# EAGLE design 3DS Cartridge (EAGLE 9.1.3)
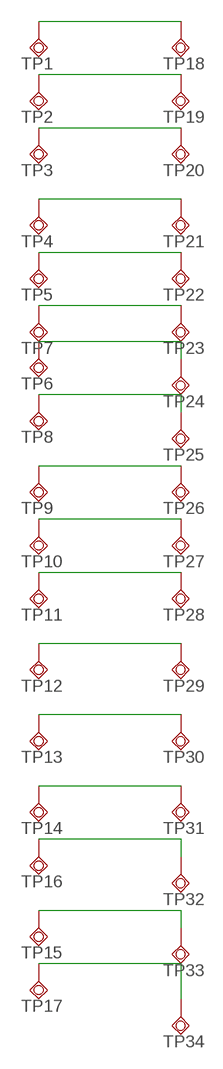
[diagram p0: schematic, sheet 1]

## Parts
TP1  TPSQTP12SQ  [TP12SQ]
TP2  TPSQTP12SQ  [TP12SQ]
TP3  TPSQTP12SQ  [TP12SQ]
TP4  TPSQTP12SQ  [TP12SQ]
TP5  TPSQTP12SQ  [TP12SQ]
TP6  TPSQTP12SQ  [TP12SQ]
TP7  TPSQTP12SQ  [TP12SQ]
TP8  TPSQTP12SQ  [TP12SQ]
TP9  TPSQTP12SQ  [TP12SQ]
TP10  TPSQTP12SQ  [TP12SQ]
TP11  TPSQTP12SQ  [TP12SQ]
TP12  TPSQTP12SQ  [TP12SQ]
TP13  TPSQTP12SQ  [TP12SQ]
TP14  TPSQTP12SQ  [TP12SQ]
TP15  TPSQTP12SQ  [TP12SQ]
TP16  TPSQTP12SQ  [TP12SQ]
TP17  TPSQTP12SQ  [TP12SQ]
TP18  TPSQTP12SQ  [TP12SQ]
TP19  TPSQTP12SQ  [TP12SQ]
TP20  TPSQTP12SQ  [TP12SQ]
TP21  TPSQTP12SQ  [TP12SQ]
TP22  TPSQTP12SQ  [TP12SQ]
TP23  TPSQTP12SQ  [TP12SQ]
TP24  TPSQTP12SQ  [TP12SQ]
TP25  TPSQTP12SQ  [TP12SQ]
TP26  TPSQTP12SQ  [TP12SQ]
TP27  TPSQTP12SQ  [TP12SQ]
TP28  TPSQTP12SQ  [TP12SQ]
TP29  TPSQTP12SQ  [TP12SQ]
TP30  TPSQTP12SQ  [TP12SQ]
TP31  TPSQTP12SQ  [TP12SQ]
TP32  TPSQTP12SQ  [TP12SQ]
TP33  TPSQTP12SQ  [TP12SQ]
TP34  TPSQTP12SQ  [TP12SQ]

## Nets
N$1: TP1.TP TP18.TP
N$2: TP2.TP TP19.TP
N$3: TP3.TP TP20.TP
N$4: TP4.TP TP21.TP
N$5: TP5.TP TP22.TP
N$6: TP7.TP TP23.TP
N$7: TP6.TP TP24.TP
N$8: TP8.TP TP25.TP
N$9: TP9.TP TP26.TP
N$10: TP10.TP TP27.TP
N$11: TP11.TP TP28.TP
N$12: TP12.TP TP29.TP
N$13: TP13.TP TP30.TP
N$14: TP14.TP TP31.TP
N$15: TP16.TP TP32.TP
N$16: TP15.TP TP33.TP
N$17: TP17.TP TP34.TP

## Library data of the parts
TP1-TP34 = testpad:TPSQ: Test pad

## Board
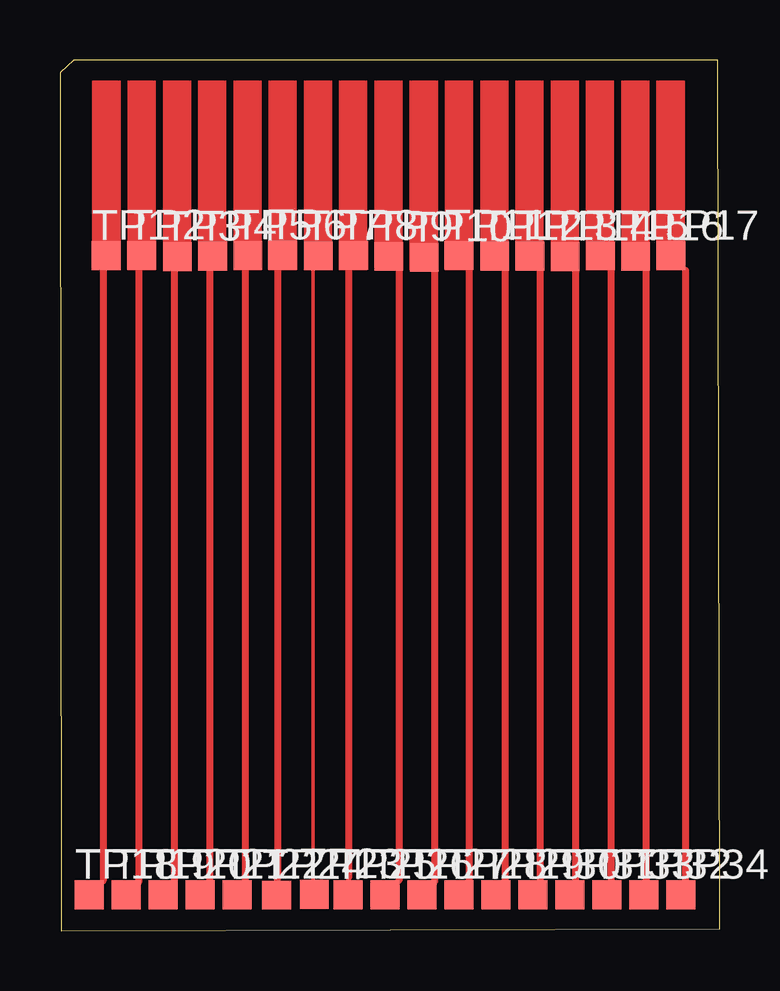
[diagram p1: board, top side]

Size 27.52 x 36.3 mm. Coordinates in mm from the lower left corner, seen from the top.
Outline: 0.05,0 27.52,0.08 27.42,36.3 0.57,36.3 0,35.76 0.05,0
Copper layers (1*16): Top 0.035mm / dielectric 1.5mm / Bottom 0.035mm
Design rules "default": minimum track width 6mil, minimum drill 0.35mm, track to track 6mil, track to pad 6mil, pad to pad 6mil, via to via 6mil, smd to smd 6mil, copper to edge 40mil, drill to drill 6mil, minimum pad ring 10mil, minimum via ring 8mil, stop-mask expansion 4mil, vias tented up to drill 0mil, thermal gap 10mil

### Footprints (pad centres in the part's own frame; a part is rotated, then mirrored left to right if it is on the bottom)
TP12SQ = smd 1.2 x 1.2: TP 0,0

### Placement (x,y rotation side)
TP1  1.92,28.14 0 top
TP2  3.4,28.15 0 top
TP3  4.89,28.1 0 top
TP4  6.37,28.11 0 top
TP5  7.84,28.15 0 top
TP6  9.28,28.16 0 top
TP7  10.77,28.13 0 top
TP8  12.24,28.15 0 top
TP9  13.71,28.11 0 top
TP10  15.19,28.07 0 top
TP11  16.64,28.15 0 top
TP12  18.13,28.12 0 top
TP13  19.59,28.12 0 top
TP14  21.06,28.1 0 top
TP15  22.54,28.13 0 top
TP16  24,28.11 0 top
TP17  25.48,28.13 0 top
TP18  1.22,1.5 0 top
TP19  2.76,1.5 0 top
TP20  4.3,1.5 0 top
TP21  5.84,1.5 0 top
TP22  7.39,1.5 0 top
TP23  10.6,1.52 0 top
TP24  9.03,1.49 0 top
TP25  12.01,1.5 0 top
TP26  13.55,1.5 0 top
TP27  15.09,1.5 0 top
TP28  16.63,1.5 0 top
TP29  18.18,1.5 0 top
TP30  19.72,1.5 0 top
TP31  21.26,1.5 0 top
TP32  24.34,1.5 0 top
TP33  22.8,1.5 0 top
TP34  25.88,1.5 0 top

### Tracks (layer width: path | path; a pad name or v marks a point on that pad's centre or on a via)
N$1
  Top 0.152: 1.8,2.08 TP18.TP | TP1.TP 1.8,28.01
  Top 0.3: 1.8,28.01 1.8,2.08
N$2
  Top 0.152: 3.28,2.01 TP19.TP | TP2.TP 3.28,28.02
  Top 0.3: 3.28,28.02 3.28,2.01
N$3
  Top 0.152: 4.77,1.96 TP20.TP | TP3.TP 4.77,27.98
  Top 0.3: 4.77,27.98 4.77,1.96
N$4
  Top 0.152: 6.24,1.9 TP21.TP | TP4.TP 6.24,27.99
  Top 0.3: 6.24,27.99 6.24,1.9
N$5
  Top 0.152: 7.71,1.82 TP22.TP | TP5.TP 7.71,28.02
  Top 0.3: 7.71,28.02 7.71,1.82
N$6
  Top 0.152: 10.55,27.91 10.55,1.57 TP23.TP
  Top 0.3: TP7.TP 10.55,27.91
N$7
  Top 0.152: 9.07,2.16 9.03,2.12 TP24.TP
  Top 0.3: 9.07,2.16 9.07,27.95 TP6.TP
N$8
  Top 0.152: 12.03,2.24 12.01,2.22 TP25.TP
  Top 0.3: 12.03,2.24 12.03,27.94 TP8.TP
N$9
  Top 0.152: 14.13,2.08 TP26.TP | TP9.TP 14.13,27.68
  Top 0.3: 14.13,27.68 14.13,2.08
N$10
  Top 0.152: 15.61,2.02 TP27.TP | TP10.TP 15.61,27.65
  Top 0.3: 15.61,27.65 15.61,2.02
N$11
  Top 0.152: 17.06,1.93 TP28.TP | TP11.TP 17.06,27.73
  Top 0.3: 17.06,27.73 17.06,1.93
N$12
  Top 0.152: 18.55,1.88 TP29.TP | TP12.TP 18.55,27.7
  Top 0.3: 18.55,27.7 18.55,1.88
N$13
  Top 0.152: 20.02,1.8 TP30.TP | TP13.TP 20.02,27.69
  Top 0.3: 20.02,27.69 20.02,1.8
N$14
  Top 0.152: 21.49,1.73 TP31.TP | TP14.TP 21.49,27.67
  Top 0.3: 21.49,27.67 21.49,1.73
N$15
  Top 0.152: 24.42,1.58 TP32.TP | TP16.TP 24.42,27.69
  Top 0.3: 24.42,27.69 24.42,1.58
N$16
  Top 0.152: 22.97,1.67 TP33.TP | TP15.TP 22.97,27.71
  Top 0.3: 22.97,27.71 22.97,1.67
N$17
  Top 0.152: 26.08,1.69 TP34.TP | TP17.TP 26.08,27.53
  Top 0.3: 26.08,27.53 26.08,1.69
(copper drawn outside any net)
  shapes: Top area x18